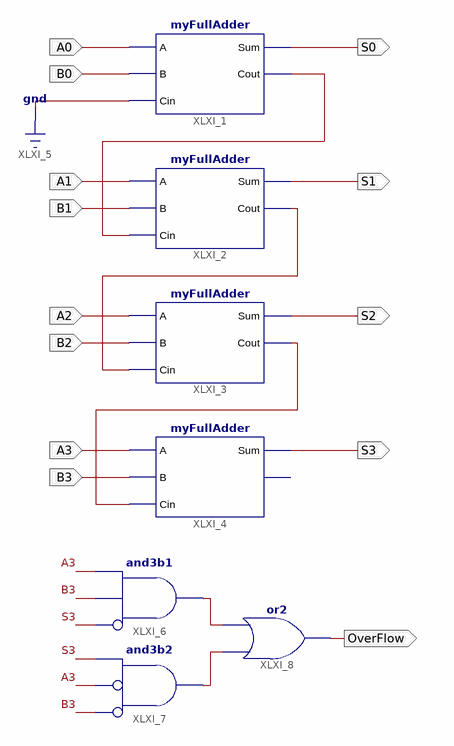
[diagram p0: schematic sheet 1]
// Xilinx ISE schematic fourBitAdder.sch (spartan6) as structural Verilog: 7 symbols, 13 ports
module fourBitAdder (
  input  A2,
  input  B2,
  input  A1,
  input  B1,
  input  B0,
  input  A0,
  input  A3,
  input  B3,
  output S0,
  output S1,
  output S2,
  output S3,
  output OverFlow
);

  wire XLXN_1, XLXN_2, XLXN_3, XLXN_30, XLXN_31;

  myFullAdder XLXI_1 (.A(A0), .B(B0), .Cin(1'b0), .Cout(XLXN_1), .Sum(S0));
  myFullAdder XLXI_2 (.A(A1), .B(B1), .Cin(XLXN_1), .Cout(XLXN_2), .Sum(S1));
  myFullAdder XLXI_3 (.A(A2), .B(B2), .Cin(XLXN_2), .Cout(XLXN_3), .Sum(S2));
  myFullAdder XLXI_4 (.A(A3), .B(B3), .Cin(XLXN_3), .Sum(S3));  // open: Cout
  and XLXI_6 (XLXN_30, ~S3, B3, A3);  // and3b1
  and XLXI_7 (XLXN_31, ~B3, ~A3, S3);  // and3b2
  or XLXI_8 (OverFlow, XLXN_31, XLXN_30);
endmodule
